# Altium schematic sheet SHIFTER.SCHDOC
size B; Organization: Altium Limited; Address1: L3, 12a Rodborough Rd; Address2: Frenchs Forest; Address3: NSW; Address4: Australia 2086; DocumentNumber: 4; SheetNumber: 4; SheetTotal: 4
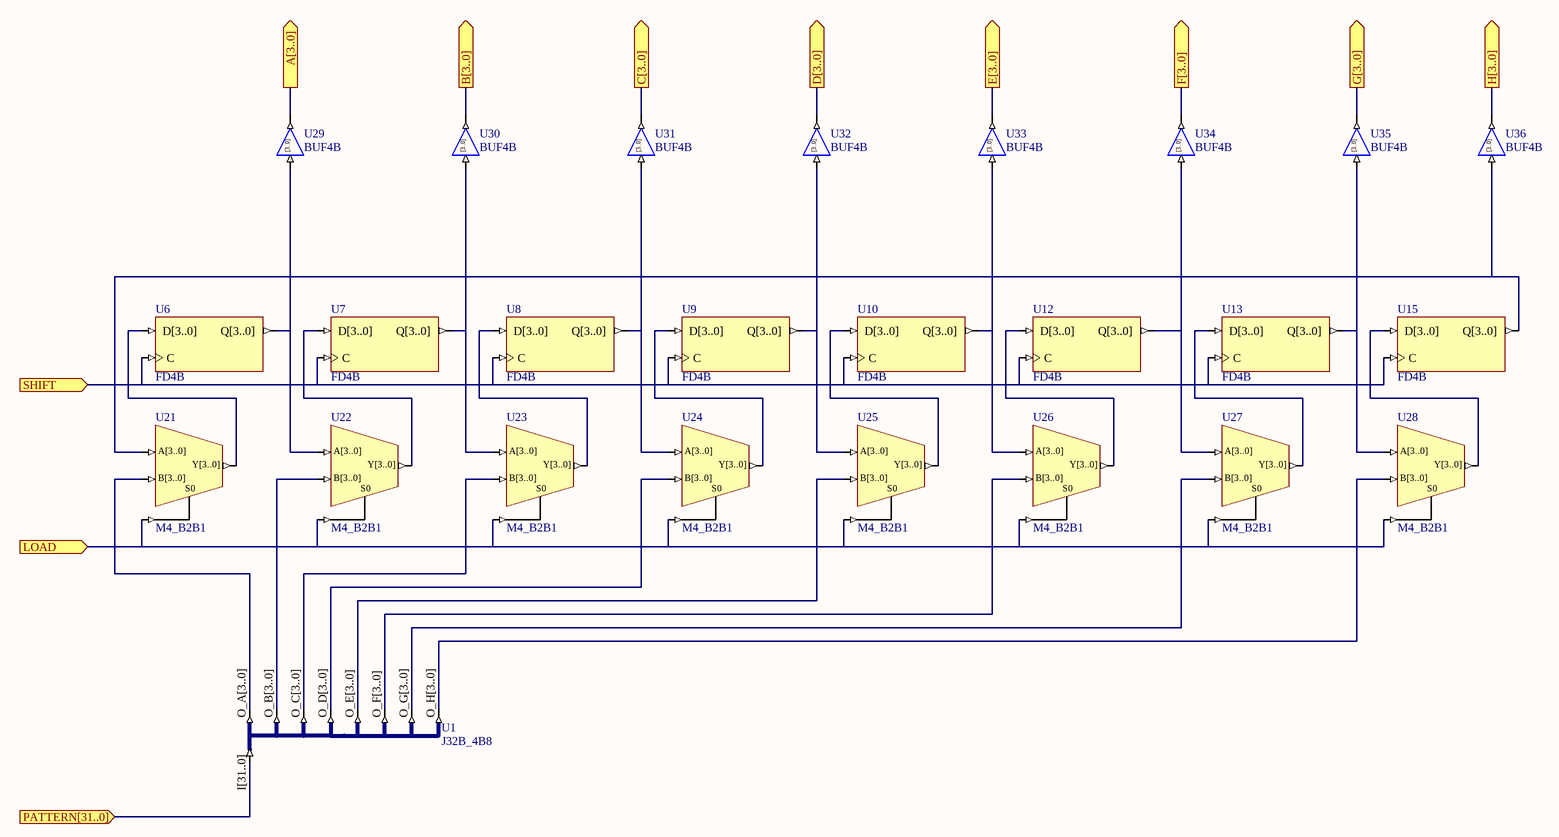
[diagram p0: SHIFTER.SCHDOC]

## Parts
U1  J32B_4B8
U6  FD4B
U7  FD4B
U8  FD4B
U9  FD4B
U10  FD4B
U12  FD4B
U13  FD4B
U15  FD4B
U21  M4_B2B1
U22  M4_B2B1
U23  M4_B2B1
U24  M4_B2B1
U25  M4_B2B1
U26  M4_B2B1
U27  M4_B2B1
U28  M4_B2B1
U29  BUF4B
U30  BUF4B
U31  BUF4B
U32  BUF4B
U33  BUF4B
U34  BUF4B
U35  BUF4B
U36  BUF4B

## Ports
A[3..0] (out), B[3..0] (out), C[3..0] (out), D[3..0] (out), E[3..0] (out), F[3..0] (out), G[3..0] (out), H[3..0] (out), LOAD (in), PATTERN[31..0] (in), SHIFT (in)

## Nets
A[3..0]: U29.O[3..0] ; port A[3..0]
B[3..0]: U30.O[3..0] ; port B[3..0]
C[3..0]: U31.O[3..0] ; port C[3..0]
D[3..0]: U32.O[3..0] ; port D[3..0]
E[3..0]: U33.O[3..0] ; port E[3..0]
F[3..0]: U34.O[3..0] ; port F[3..0]
G[3..0]: U35.O[3..0] ; port G[3..0]
H[3..0]: U36.O[3..0] ; port H[3..0]
LOAD: U21.S0 U22.S0 U23.S0 U24.S0 U25.S0 U26.S0 U27.S0 U28.S0 ; port LOAD
PATTERN[31..0]: U1.I[31..0] ; port PATTERN[31..0]
SHIFT: U6.C U7.C U8.C U9.C U10.C U12.C U13.C U15.C ; port SHIFT
NetU1_O_A[3..0]: U1.O_A[3..0] U21.B[3..0]
NetU1_O_B[3..0]: U1.O_B[3..0] U22.B[3..0]
NetU1_O_C[3..0]: U1.O_C[3..0] U23.B[3..0]
NetU1_O_D[3..0]: U1.O_D[3..0] U24.B[3..0]
NetU1_O_E[3..0]: U1.O_E[3..0] U25.B[3..0]
NetU1_O_F[3..0]: U1.O_F[3..0] U26.B[3..0]
NetU1_O_G[3..0]: U1.O_G[3..0] U27.B[3..0]
NetU1_O_H[3..0]: U1.O_H[3..0] U28.B[3..0]
NetU6_D[3..0]: U6.D[3..0] U21.Y[3..0]
NetU6_Q[3..0]: U6.Q[3..0] U22.A[3..0] U29.I[3..0]
NetU7_D[3..0]: U7.D[3..0] U22.Y[3..0]
NetU7_Q[3..0]: U7.Q[3..0] U23.A[3..0] U30.I[3..0]
NetU8_D[3..0]: U8.D[3..0] U23.Y[3..0]
NetU8_Q[3..0]: U8.Q[3..0] U24.A[3..0] U31.I[3..0]
NetU9_D[3..0]: U9.D[3..0] U24.Y[3..0]
NetU9_Q[3..0]: U9.Q[3..0] U25.A[3..0] U32.I[3..0]
NetU10_D[3..0]: U10.D[3..0] U25.Y[3..0]
NetU10_Q[3..0]: U10.Q[3..0] U26.A[3..0] U33.I[3..0]
NetU12_D[3..0]: U12.D[3..0] U26.Y[3..0]
NetU12_Q[3..0]: U12.Q[3..0] U27.A[3..0] U34.I[3..0]
NetU13_D[3..0]: U13.D[3..0] U27.Y[3..0]
NetU13_Q[3..0]: U13.Q[3..0] U28.A[3..0] U35.I[3..0]
NetU15_D[3..0]: U15.D[3..0] U28.Y[3..0]
NetU15_Q[3..0]: U15.Q[3..0] U21.A[3..0] U36.I[3..0]

## Notes on the sheet
- Title
- Size:
- Date:
- B
- Number:
- Time:
- Revision:
- Sheet
- of
- File:
- (in symbol BUF4B) [3..0]

## Library data of the parts
U1 = J32B_4B8: 1 x 32-Bit input bus to 8 x 4-Bit output bus; ArchiveName: GENERIC; Published: 18-Dec-2003; Publisher: Altium Limited; Core Revision: 1.00.00
U6-U10 U12 U13 U15 = FD4B: 4-Bit D-Type Flip-Flop, Bus Version; ArchiveName: GENERIC; Published: 18-Dec-2003; Publisher: Altium Limited; Core Revision: 1.00.00
U21-U28 = M4_B2B1: 2x4-Bit Bus to 1x4-Bit Bus Multiplexer; ArchiveName: GENERIC; Published: 18-Dec-2003; Publisher: Altium Limited; Core Revision: 1.00.00
U29-U36 = BUF4B: 4-Bit General Purpose (Non-inverting) Buffer, Bus Version; ArchiveName: GENERIC; Published: 18-Dec-2003; Publisher: Altium Limited; Core Revision: 1.00.00